# EAGLE design LN2 Autofill Connectors (EAGLE 9.6.2)
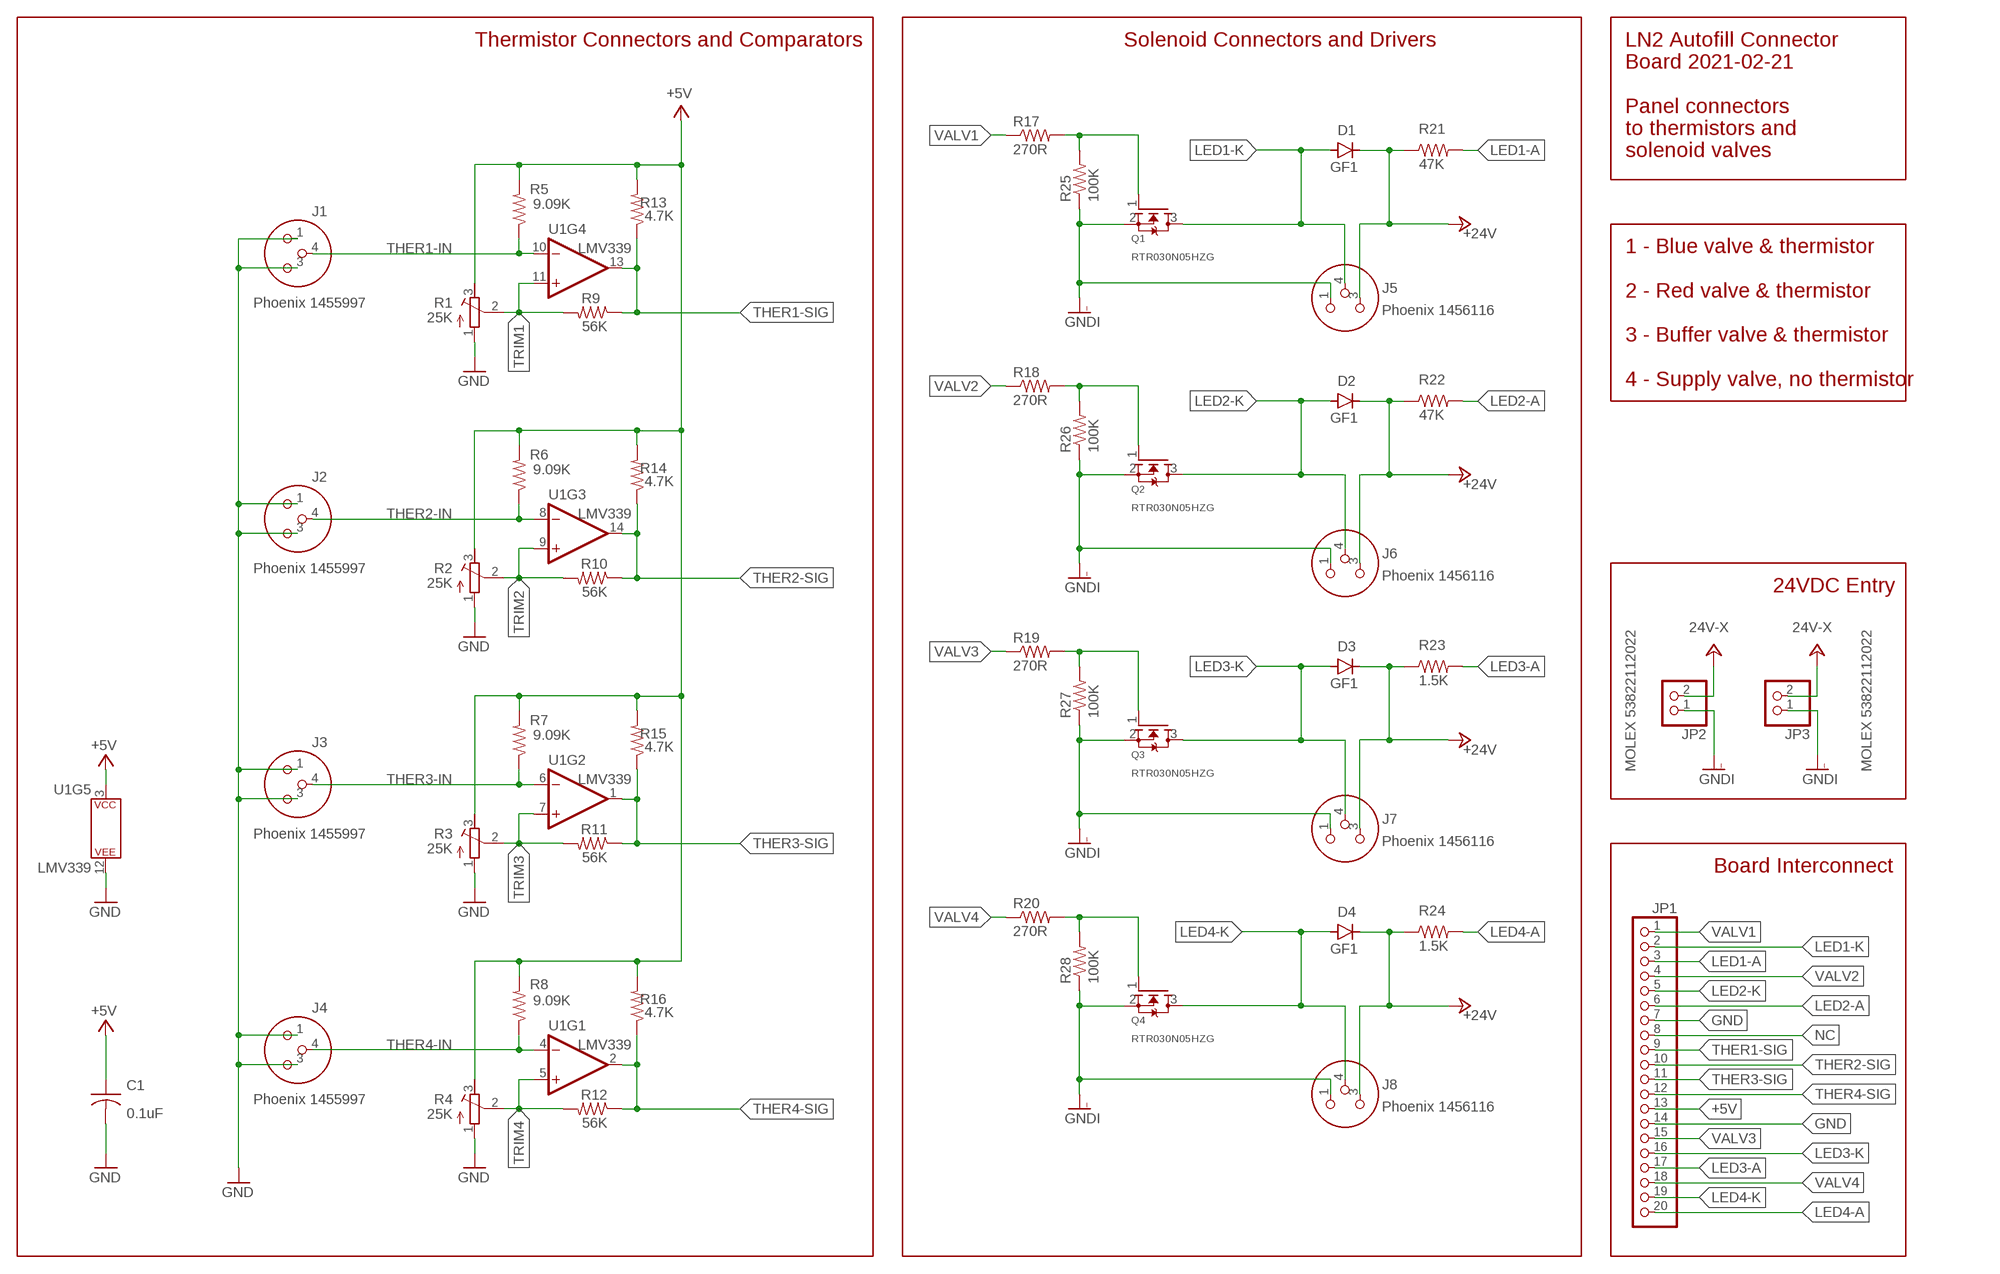
[diagram p0: schematic, sheet 1]

## Parts
C1  0.1uF  C-USC0805  [C0805]
D1  GF1  [SMA-DO214AC]
D2  GF1  [SMA-DO214AC]
D3  GF1  [SMA-DO214AC]
D4  GF1  [SMA-DO214AC]
J1  Phoenix 1455997  PHOENIX-3PIN-MALE  [PHOENIX-3PIN]
J2  Phoenix 1455997  PHOENIX-3PIN-MALE  [PHOENIX-3PIN]
J3  Phoenix 1455997  PHOENIX-3PIN-MALE  [PHOENIX-3PIN]
J4  Phoenix 1455997  PHOENIX-3PIN-MALE  [PHOENIX-3PIN]
J5  Phoenix 1456116  PHOENIX-3PIN-FEMALE  [PHOENIX-3PIN-FEMALE]
J6  Phoenix 1456116  PHOENIX-3PIN-FEMALE  [PHOENIX-3PIN-FEMALE]
J7  Phoenix 1456116  PHOENIX-3PIN-FEMALE  [PHOENIX-3PIN-FEMALE]
J8  Phoenix 1456116  PHOENIX-3PIN-FEMALE  [PHOENIX-3PIN-FEMALE]
JP1  PINHD-1X20  [1X20]
JP2  MOLEX 53822112022  PINHD-1X2MOLEX-02-VERT  [MOLEX-02-VERT]
JP3  MOLEX 53822112022  PINHD-1X2MOLEX-02-VERT  [MOLEX-02-VERT]
Q1  RTR030N05HZG  MOSFET-NREFLOW  [SOT23]
Q2  RTR030N05HZG  MOSFET-NREFLOW  [SOT23]
Q3  RTR030N05HZG  MOSFET-NREFLOW  [SOT23]
Q4  RTR030N05HZG  MOSFET-NREFLOW  [SOT23]
R1  25K  R-TRIMM3296Y  [RTRIM3296Y]
R2  25K  R-TRIMM3296Y  [RTRIM3296Y]
R3  25K  R-TRIMM3296Y  [RTRIM3296Y]
R4  25K  R-TRIMM3296Y  [RTRIM3296Y]
R5  9.09K  R-US_R0805  [R0805]
R6  9.09K  R-US_R0805  [R0805]
R7  9.09K  R-US_R0805  [R0805]
R8  9.09K  R-US_R0805  [R0805]
R9  56K  R-US_R0805  [R0805]
R10  56K  R-US_R0805  [R0805]
R11  56K  R-US_R0805  [R0805]
R12  56K  R-US_R0805  [R0805]
R13  4.7K  R-US_R0805  [R0805]
R14  4.7K  R-US_R0805  [R0805]
R15  4.7K  R-US_R0805  [R0805]
R16  4.7K  R-US_R0805  [R0805]
R17  270R  R-US_R0805  [R0805]
R18  270R  R-US_R0805  [R0805]
R19  270R  R-US_R0805  [R0805]
R20  270R  R-US_R0805  [R0805]
R21  47K  R-US_R0805  [R0805]
R22  47K  R-US_R0805  [R0805]
R23  1.5K  R-US_R0805  [R0805]
R24  1.5K  R-US_R0805  [R0805]
R25  100K  R-US_R0805  [R0805]
R26  100K  R-US_R0805  [R0805]
R27  100K  R-US_R0805  [R0805]
R28  100K  R-US_R0805  [R0805]
U1  LMV339  LM339SOIC-14  [SOIC127P599X175-14]

## Nets
+5V: C1.1 JP1.13 R1.3(E) R2.3(E) R3.3(E) R4.3(E) R5.2 R6.2 R7.2 R8.2 R13.2 R14.2 R15.2 R16.2 U1.3(P$V+)
+24V: D1.K(C) D2.K(C) D3.K(C) D4.K(C) J5.3 J6.3 J7.3 J8.3 JP2.2 JP3.2 R21.1 R22.1 R23.1 R24.1 ; supply symbol labelled 24V-X
GND: C1.2 J1.1 J1.3 J2.1 J2.3 J3.1 J3.3 J4.1 J4.3 JP1.7 JP1.14 R1.1(A) R2.1(A) R3.1(A) R4.1(A) U1.12(P$V-)
GNDI: J5.1 J6.1 J7.1 J8.1 JP2.1 JP3.1 Q1.2(S) Q2.2(S) Q3.2(S) Q4.2(S) R25.1 R26.1 R27.1 R28.1
LED1-A: JP1.3 R21.2
LED1-K: D1.A J5.4 JP1.2 Q1.3(D)
LED2-A: JP1.6 R22.2
LED2-K: D2.A J6.4 JP1.5 Q2.3(D)
LED3-A: JP1.17 R23.2
LED3-K: D3.A J7.4 JP1.16 Q3.3(D)
LED4-A: JP1.20 R24.2
LED4-K: D4.A J8.4 JP1.19 Q4.3(D)
N$1: Q1.1(G) R17.2 R25.2
N$2: Q2.1(G) R18.2 R26.2
N$3: Q3.1(G) R19.2 R27.2
N$4: Q4.1(G) R20.2 R28.2
NC: JP1.8
THER1-IN: J1.4 R5.1 U1.10(-IN)
THER1-SIG: JP1.9 R9.1 R13.1 U1.13(OUT)
THER2-IN: J2.4 R6.1 U1.8(-IN)
THER2-SIG: JP1.10 R10.1 R14.1 U1.14(OUT)
THER3-IN: J3.4 R7.1 U1.6(-IN)
THER3-SIG: JP1.11 R11.1 R15.1 U1.1(OUT)
THER4-IN: J4.4 R8.1 U1.4(-IN)
THER4-SIG: JP1.12 R12.1 R16.1 U1.2(OUT)
TRIM1: R1.2(S) R9.2 U1.11(+IN)
TRIM2: R2.2(S) R10.2 U1.9(+IN)
TRIM3: R3.2(S) R11.2 U1.7(+IN)
TRIM4: R4.2(S) R12.2 U1.5(+IN)
VALV1: JP1.1 R17.1
VALV2: JP1.4 R18.1
VALV3: JP1.15 R19.1
VALV4: JP1.18 R20.1

## Notes on the sheet
- Thermistor Connectors and Comparators | Solenoid Connectors and Drivers
- LN2 Autofill Connector
  Board 2021-02-21
  
  Panel connectors
  to thermistors and
  solenoid valves
- 1 - Blue valve & thermistor
  
  2 - Red valve & thermistor
  
  3 - Buffer valve & thermistor
  
  4 - Supply valve, no thermistor
- 24VDC Entry
- Board Interconnect

## Library data of the parts
C1 = AUmlib:C-US: CAPACITOR, American symbol; SPICEPREFIX: C
D1-D4 = AUmlib:GF1: DIODE
J1-J4 = AUmlib:PHOENIX-3PIN-MALE
J5-J8 = AUmlib:PHOENIX-3PIN-FEMALE: Phoenix Contact 3-pin circular M8 female PCB 1456116
JP1 = AUmlib:PINHD-1X20: PIN HEADER
JP2 JP3 = AUmlib:PINHD-1X2: PIN HEADER
Q1-Q4 = AUmlib:MOSFET-N: N-Channel Mosfet 2N7002E - 60V 260mA SOT23 [Digikey: 2N7002ET1GOSTR-ND] - REEL BSH103 - 30V 850mA SOT23 [Digikey: 568-5013-1-ND]
R1-R4 = AUmlib:R-TRIMM: Trimm resistor; SPICEMODEL: X; SPICEPREFIXL: POT
R5-R28 = AUmlib:R-US_: RESISTOR, American symbol; SPICEPREFIX: R
U1 = AUmlib:LM339: Quad Comparator - LM339PWR Based on information from the SLCS006N datasheet from TI (www.ti.com). Created by nick@scantool.net, 2008. Updated 2016. SparkFun Products SparkFun OBD-II UART <https://www.sparkfun.com/products/9555> (WIG-09555) SparkFun Car Diagnostics Kit <https://www.sparkfun.com/products/10769> (RTL-10769)

## Board
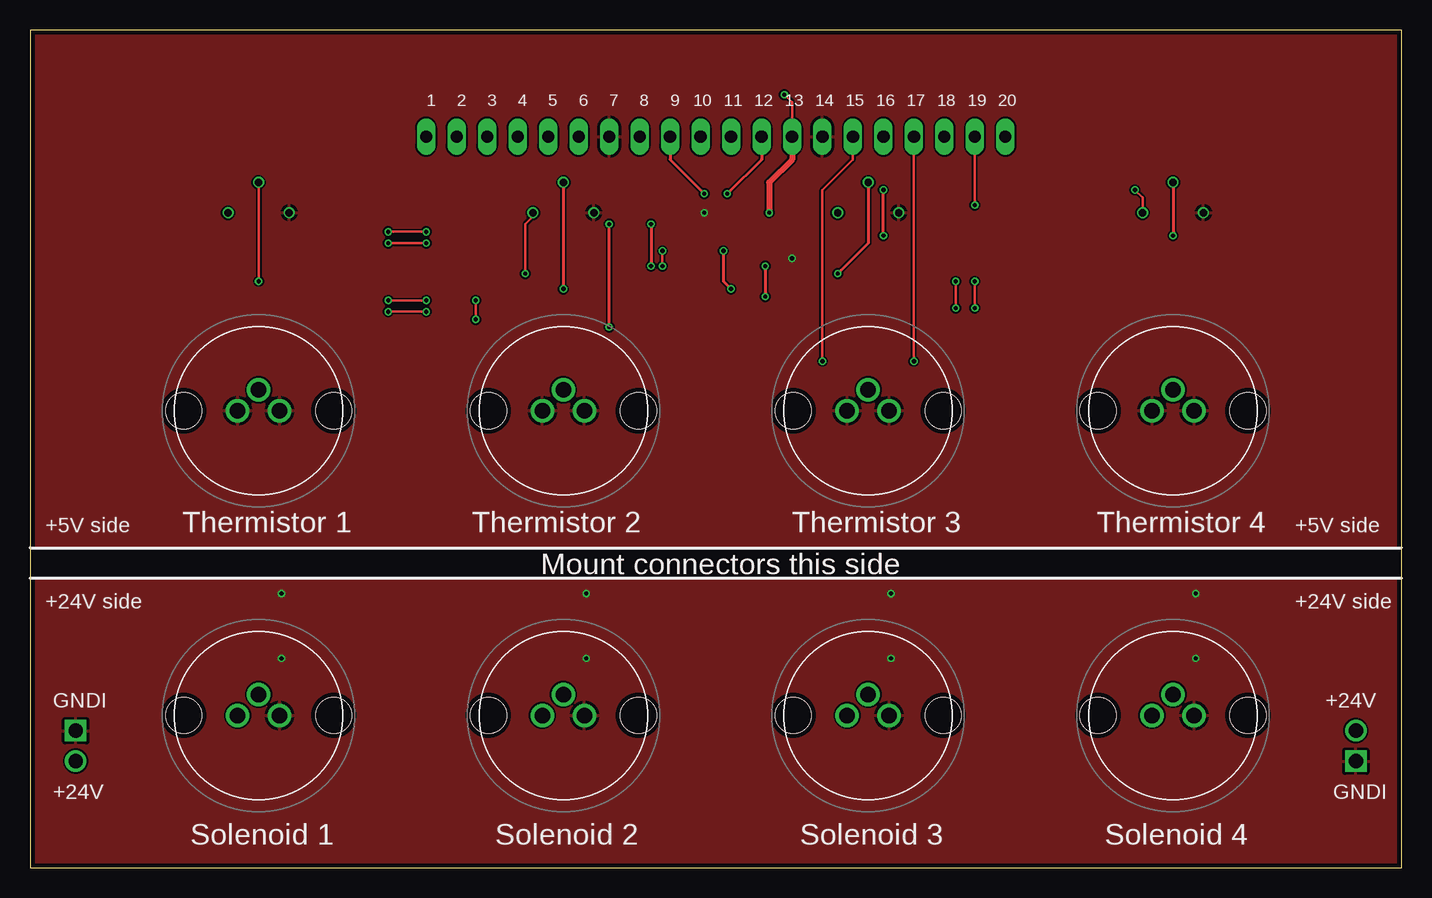
[diagram p1: board, top side]
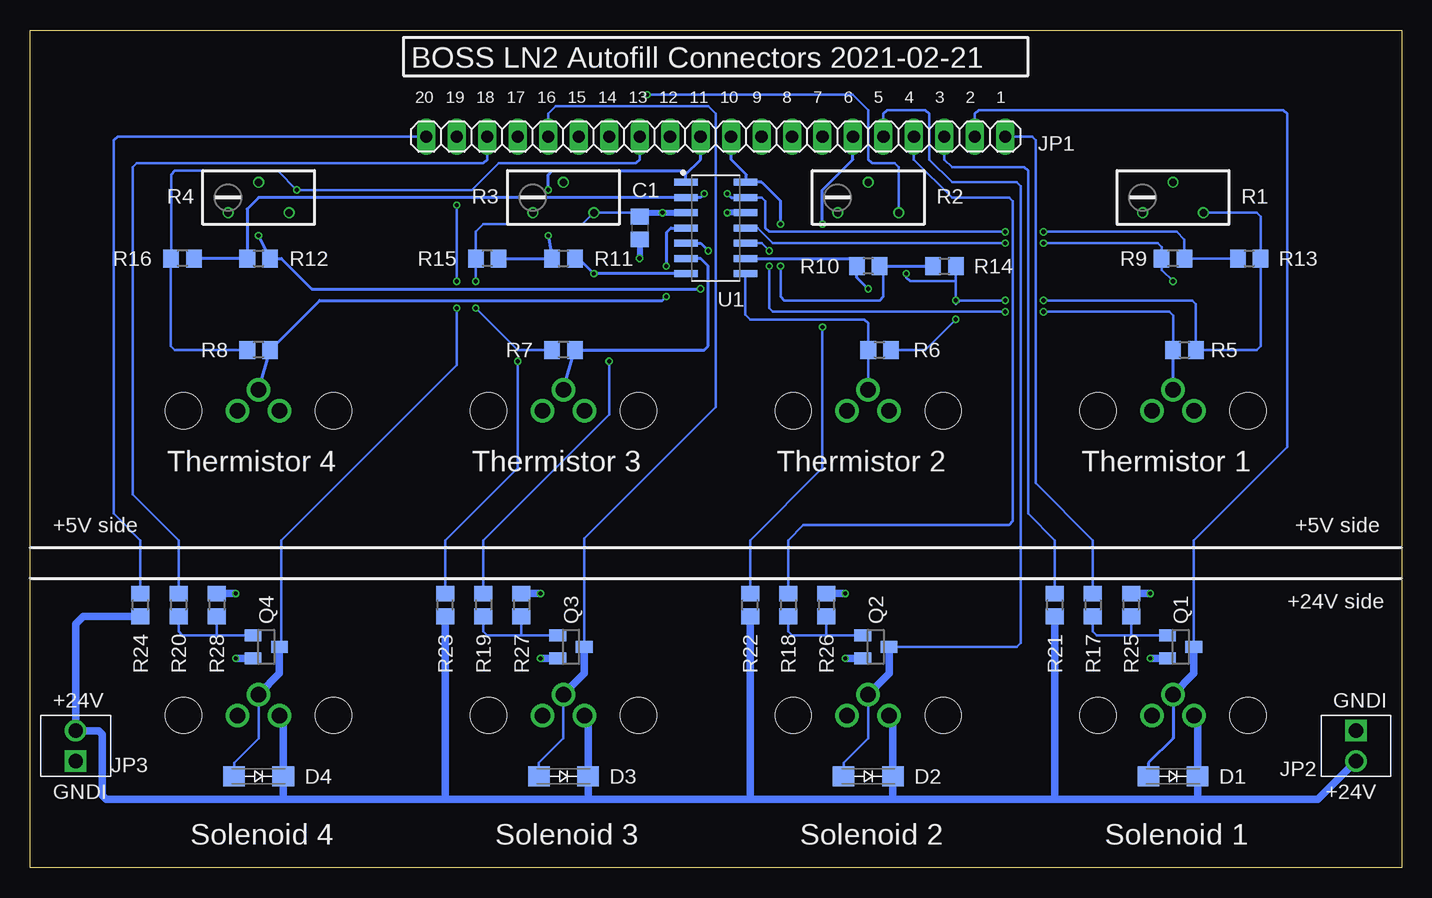
[diagram p2: board, bottom side, seen from below]

Size 114.3 x 69.85 mm. Coordinates in mm from the lower left corner, seen from the top.
Outline: 0,0 114.3,0 114.3,69.85 0,69.85 0,0
Copper layers (1*16): Top 0.035559375mm / dielectric 1.6mm / Bottom 0.035559375mm
Design rules "oshpark-2layer *": minimum track width 6mil, minimum drill 10mil, track to track 6mil, track to pad 6mil, pad to pad 6mil, via to via 6mil, smd to smd 6mil, copper to edge 15mil, drill to drill 6mil, minimum pad ring 5mil, minimum via ring 5mil, stop-mask expansion 2.5mil, vias tented up to drill 0mil, thermal gap 10mil

### Footprints (pad centres in the part's own frame; a part is rotated, then mirrored left to right if it is on the bottom)
C0805 = smd 1.3 x 1.5: 1 -0.95,0; 2 0.95,0
SMA-DO214AC = smd 1.8 x 1.7: A -2.05,0; K 2.05,0
PHOENIX-3PIN = drill 1.3: 1 1.75,0; 3 -1.75,0; 4 0,1.75 | hole 3: -6.25,0; 6.25,0
PHOENIX-3PIN-FEMALE = drill 1.3: 1 1.75,0; 3 -1.75,0; 4 0,1.75 | hole 3: -6.25,0; 6.25,0
1X20 = drill 1.016 long: 1 -24.13,0; 2 -21.59,0; 3 -19.05,0; 4 -16.51,0; 5 -13.97,0; 6 -11.43,0; 7 -8.89,0; 8 -6.35,0; 9 -3.81,0; 10 -1.27,0; 11 1.27,0; 12 3.81,0; 13 6.35,0; 14 8.89,0; 15 11.43,0; 16 13.97,0; 17 16.51,0; 18 19.05,0; 19 21.59,0; 20 24.13,0
MOLEX-02-VERT = drill 1.194 square: 1 0,0 | drill 1.194: 2 2.54,0
SOT23 = smd 1 x 1.4: 1 -0.95,-1.1; 2 0.95,-1.1; 3 0,1.1
RTRIM3296Y = drill 0.61: 1 1.27,-2.54; 2 -1.27,0; 3 1.27,2.54
R0805 = smd 1.3 x 1.5: 1 -0.95,0; 2 0.95,0
SOIC127P599X175-14 = smd 1.967 x 0.594: 1 -2.469,3.81; 2 -2.469,2.54; 3 -2.469,1.27; 4 -2.469,0; 5 -2.469,-1.27; 6 -2.469,-2.54; 7 -2.469,-3.81; 8 2.469,-3.81; 9 2.469,-2.54; 10 2.469,-1.27; 11 2.469,0; 12 2.469,1.27; 13 2.469,2.54; 14 2.469,3.81

### Placement (x,y rotation side)
C1  63.5,53.34 270 bottom
D1  19.05,7.62 0 bottom
D2  44.45,7.62 0 bottom
D3  69.85,7.62 0 bottom
D4  95.25,7.62 0 bottom
J1  19.05,38.1 0 top
J2  44.45,38.1 0 top
J3  69.85,38.1 0 top
J4  95.25,38.1 0 top
J5  19.05,12.7 0 top
J6  44.45,12.7 0 top
J7  69.85,12.7 0 top
J8  95.25,12.7 0 top
JP1  57.15,60.96 180 bottom
JP2  3.81,11.43 270 bottom
JP3  110.49,8.89 90 bottom
Q1  18.41,18.41 270 bottom
Q2  43.81,18.41 270 bottom
Q3  69.22,18.41 270 bottom
Q4  94.61,18.41 270 bottom
R1  19.05,55.88 270 bottom
R2  44.45,55.88 270 bottom
R3  69.85,55.88 270 bottom
R4  95.25,55.88 270 bottom
R5  18.1,43.18 0 bottom
R6  43.5,43.18 0 bottom
R7  69.85,43.18 180 bottom
R8  95.25,43.18 180 bottom
R9  19.05,50.8 180 bottom
R10  44.45,50.16 180 bottom
R11  69.85,50.8 0 bottom
R12  95.25,50.8 0 bottom
R13  12.7,50.8 0 bottom
R14  38.1,50.16 0 bottom
R15  76.2,50.8 180 bottom
R16  101.6,50.8 180 bottom
R17  25.72,21.91 270 bottom
R18  51.12,21.91 270 bottom
R19  76.52,21.91 270 bottom
R20  101.92,21.91 270 bottom
R21  1.5K  [R0805]  28.89,21.91 90 bottom
R22  1.5K  [R0805]  54.29,21.91 90 bottom
R23  79.69,21.91 90 bottom
R24  105.09,21.91 90 bottom
R25  22.54,21.91 270 bottom
R26  47.94,21.91 270 bottom
R27  73.34,21.91 270 bottom
R28  98.74,21.91 270 bottom
U1  57.15,53.34 0 bottom

### Tracks (layer width: path | path; a pad name or v marks a point on that pad's centre or on a via)
+5V  (via drill 0.35)
  Top 0.203: v37.15,47.31 v37.15,45.72 | R2.3 41.91,54.29 41.27,53.66 v41.27,49.53 | v92.08,56.52 92.71,55.88 R4.3 | v77.15,48.9 v77.15,46.67 | v62.87,64.45 63.5,63.82 JP1.13 | v29.84,47.31 v33.02,47.31
  Top 0.508: JP1.13 63.5,59.05 61.59,57.15 v61.59,54.61
  Bottom 0.203: R1.3 12.06,54.61 11.75,54.29 R13.2 11.75,43.5 12.06,43.18 R5.2 17.14,46.99 17.46,47.31 v29.84,47.31 | R14.2 37.15,48.9 | 37.15,48.9 v37.15,47.31 | v37.15,47.31 37.15,46.99 36.84,47.31 v33.02,47.31 | v37.15,47.31 | v37.15,45.72 39.69,43.18 R6.2 | v41.27,49.53 41.27,49.21 40.96,48.9 37.15,48.9 | 63.34,54.45 63.5,54.61 R3.3 68.26,53.66 76.52,53.66 77.15,53.02 R15.2 v77.15,48.9 | JP1.13 63.5,59.05 63.82,58.74 75.25,58.74 77.47,56.52 v92.08,56.52 93.66,58.1 102.23,58.1 102.55,57.79 R16.2 102.55,43.5 102.23,43.18 R8.2 | v77.15,46.67 73.66,43.18 R7.2 | R2.3 41.91,58.42 42.23,58.74 44.13,58.74 44.45,59.05 44.45,63.18 45.72,64.45 v62.87,64.45
  Bottom 0.508: U1.3 v61.59,54.61 v61.6,54.61 63.18,54.61 63.34,54.45 C1.1
  Bottom 0.61: R13.2
+24V
  Bottom 0.61: J5.3 17,12.4 D1.K 17,5.86 17.14,5.71 | J6.3 42.4,12.4 D2.K 42.4,5.89 42.23,5.71 | J7.3 67.8,12.4 D3.K 67.8,5.86 67.94,5.71 | J8.3 93.2,12.4 D4.K 93.2,5.86 93.34,5.71 | R24.1 109.85,20.96 110.49,20.32 JP3.2 108.58,11.43 108.27,11.11 108.27,6.03 107.95,5.71 93.34,5.71 | JP2.2 6.99,5.71 17.14,5.71 | 17.14,5.71 28.89,5.71 | 28.89,5.71 42.23,5.71 | 42.23,5.71 54.29,5.71 | 54.29,5.71 67.94,5.71 | 67.94,5.71 79.69,5.71 | 79.69,5.71 93.34,5.71 | R21.1 28.89,5.71 | R22.1 54.29,5.71 | R23.1 79.69,5.71
GND  (via drill 0.35)
  Bottom 0.508: C1.2 v63.5,50.8 | U1.12 v56.2,54.61
  pour Top: 0,69.85 114.3,69.85 114.3,26.67 0,26.67
GNDI  (via drill 0.35)
  Bottom 0.61: Q1.2 v20.95,17.46 | v20.95,22.86 v20.96,22.86 R25.1 | Q2.2 v46.35,17.46 | R26.1 v46.36,22.86 v46.35,22.86 | Q3.2 v71.75,17.46 | R27.1 v71.76,22.86 v71.75,22.86 | Q4.2 v97.16,17.46 | R28.1 v97.16,22.86
  pour Top: 0,0 0,24.13 114.3,24.13 114.3,0
LED1-A
  Bottom 0.203: JP1.3 38.1,59.05 37.47,58.42 31.43,58.42 31.11,58.1 31.11,29.53 28.89,27.3 R21.2
LED1-K
  Bottom 0.203: JP1.2 35.56,62.87 35.24,63.18 9.84,63.18 9.53,62.87 9.53,35.09 17.32,27.3 Q1.3
  Bottom 0.254: J5.4 19.05,10.79 21.1,8.74 D1.A
  Bottom 0.61: J5.4 17.32,16.18 Q1.3
LED2-A  (via drill 0.35)
  Top 0.254: v48.26,45.09 v48.26,53.66
  Bottom 0.203: v48.26,45.09 48.26,33.34 54.29,27.3 R22.2
  Bottom 0.254: v48.26,53.66 48.26,56.52 45.72,59.05 JP1.6
LED2-K
  Bottom 0.203: JP1.5 43.18,62.87 42.86,63.18 39.69,63.18 39.37,62.87 39.37,59.05 37.47,57.15 32.07,57.15 31.75,56.83 31.75,18.73 32.07,18.41 Q2.3 | J6.4 44.45,10.79 46.5,8.74 D2.A
  Bottom 0.61: Q2.3 42.72,16.18 J6.4
LED3-A  (via drill 0.35)
  Top 0.203: v73.66,42.23 JP1.17
  Bottom 0.203: v73.66,42.23 73.66,33.34 79.69,27.3 R23.2
LED3-K
  Bottom 0.203: JP1.16 71.12,62.87 70.48,63.5 57.78,63.5 57.15,62.87 57.15,38.42 68.11,27.45 Q3.3 | J7.4 69.85,10.79 71.9,8.74 D3.A
  Bottom 0.61: Q3.3 68.11,16.18 J7.4
LED4-A
  Bottom 0.203: R24.2 105.09,27.3 107.31,29.53 107.31,60.64 107,60.96 JP1.20
LED4-K  (via drill 0.35)
  Top 0.203: v78.74,46.67 v78.74,48.9 | v78.74,55.24 JP1.19
  Bottom 0.203: D4.A 97.3,8.74 95.25,10.79 J8.4 | Q4.3 93.34,18.59 93.34,27.3 78.74,41.91 v78.74,46.67 | v78.74,48.9 v78.74,55.24
  Bottom 0.61: Q4.3 93.52,16.18 J8.4
N$1
  Bottom 0.203: Q1.1 22.54,19.36 | 22.54,19.36 25.4,19.36 25.72,19.68 R17.2 | R25.2 22.54,19.36
N$2
  Bottom 0.203: Q2.1 47.94,19.36 | 47.94,19.36 50.8,19.36 51.12,19.68 R18.2 | R26.2 47.94,19.36
N$3
  Bottom 0.203: Q3.1 73.34,19.36 | 73.34,19.36 76.2,19.36 76.52,19.68 R19.2 | R27.2 73.34,19.36
N$4
  Bottom 0.203: Q4.1 98.74,19.37 | 98.74,19.37 101.6,19.37 101.92,19.68 R20.2 | R28.2 98.74,19.37
THER1-IN  (via drill 0.35)
  Top 0.203: v52.7,51.44 v52.7,50.16 | v33.02,46.35 v29.84,46.35
  Bottom 0.203: R5.1 19.05,46.04 19.36,46.35 v29.84,46.35 | v52.7,51.44 53.34,52.07 U1.10 | v52.7,50.16 52.7,46.67 52.39,46.35 v33.02,46.35
  Bottom 0.254: J1.4 R5.1
THER1-SIG  (via drill 0.35)
  Top 0.203: v29.84,53.02 v33.02,53.02
  Top 0.254: JP1.9 53.34,59.05 v56.2,56.2
  Bottom 0.203: R13.1 R9.1 18.1,52.39 18.73,53.02 v29.84,53.02 | U1.13 53.34,55.88 53.02,55.56 53.02,53.34 52.7,53.02 v33.02,53.02
  Bottom 0.254: v56.2,56.2 55.88,55.88 U1.13
THER2-IN
  Bottom 0.203: R6.1 44.45,45.4 44.77,45.72 54.29,45.72 54.68,46.11 U1.8 | J2.4 R6.1
  Bottom 0.254: R6.1
THER2-SIG  (via drill 0.35)
  Top 0.254: v51.75,53.66 v51.75,50.16
  Bottom 0.203: 43.18,49.84 43.18,47.62 43.5,47.31 51.44,47.31 51.75,47.62 v51.75,50.16
  Bottom 0.254: JP1.10 55.88,59.05 54.61,57.78 54.61,57.22 U1.14 53.34,57.15 51.75,55.56 v51.75,53.66 | R14.1 R10.1 43.18,49.84
THER3-IN
  Bottom 0.254: U1.6 58.42,50.8 57.78,50.16 57.78,43.5 58.1,43.18 R7.1 J3.4
THER3-SIG  (via drill 0.35)
  Top 0.254: v71.12,52.7 v71.12,56.52
  Bottom 0.254: U1.1 59.69,57.22 59.69,57.78 | 59.69,57.78 58.42,59.05 JP1.11 | v71.12,56.52 71.12,57.78 70.8,58.1 60.01,58.1 59.69,57.78 | R15.1 R11.1 v71.12,52.7
THER4-IN  (via drill 0.35)
  Top 0.254: v61.28,50.16 v61.28,47.62
  Bottom 0.254: v61.28,47.62 61.59,47.31 90.17,47.31 R8.1 J4.4 | v61.28,50.16 61.28,52.95 60.89,53.34 U1.4
THER4-SIG  (via drill 0.35)
  Top 0.254: JP1.12 60.96,59.05 v58.1,56.2
  Bottom 0.254: v58.1,56.2 58.42,55.88 U1.2 95.25,55.88 96.2,54.93 R12.1 R16.1
TRIM1  (via drill 0.35)
  Top 0.203: R1.2 v19.05,48.9 | v29.84,52.07 v33.02,52.07
  Bottom 0.203: U1.11 53.66,53.34 52.39,52.07 v33.02,52.07 | v19.05,48.9 20,49.84 R9.2 20,51.75 20.32,52.07 v29.84,52.07
TRIM2  (via drill 0.35)
  Top 0.254: R2.2 v44.45,48.26
  Bottom 0.254: U1.9 46.03,50.8 R10.2 45.4,49.21 v44.45,48.26
TRIM3  (via drill 0.35)
  Top 0.254: R3.2 69.85,52.07 v67.31,49.53
  Bottom 0.254: U1.7 v67.31,49.53 68.58,50.8 R11.2
TRIM4  (via drill 0.35)
  Top 0.254: R4.2 v95.25,52.7 | v57.78,51.44 57.78,48.9 v58.42,48.26
  Bottom 0.254: U1.5 58.42,52.07 v57.78,51.44 | v58.42,48.26 90.81,48.26 93.34,50.8 R12.2 v95.25,52.7
VALV1
  Bottom 0.203: JP1.1 30.8,60.96 30.48,60.64 30.48,32.07 25.72,27.3 R17.1
VALV2
  Bottom 0.203: JP1.4 40.64,59.05 37.47,55.88 32.7,55.88 32.38,55.56 32.38,28.89 32.7,28.57 49.85,28.57 51.12,27.3 R18.1
VALV3  (via drill 0.35)
  Top 0.203: v66.04,42.23 66.04,56.52 68.58,59.05 JP1.15
  Bottom 0.203: v66.04,42.23 66.04,37.78 76.52,27.3 R19.1
VALV4
  Bottom 0.203: R20.1 101.92,27.3 105.73,31.11 105.73,58.42 105.41,58.74 76.52,58.74 76.2,59.05 JP1.18

### Text on the board
tPlace: 1 | 2 | 3 | 4 | 5 | 6 | 7 | 8 | 9 | 10 | 11 | 12 | 13 | 14 | 15 | 16 | 17 | 18 | 19 | 20 | +5V side | Thermistor 1 | Thermistor 2 | Thermistor 3 | Thermistor 4 | +5V side | Mount connectors this side | +24V side | +24V side | GNDI | +24V | +24V | GNDI | Solenoid 1 | Solenoid 2 | Solenoid 3 | Solenoid 4
bPlace: BOSS LN2 Autofill Connectors 2021-02-21 | 1 | 2 | 3 | 4 | 5 | 6 | 7 | 8 | 9 | 10 | 11 | 12 | 13 | 14 | 15 | 16 | 17 | 18 | 19 | 20 | Thermistor 1 | Thermistor 2 | Thermistor 3 | Thermistor 4 | +5V side | +5V side | +24V side | GNDI | +24V | +24V | GNDI | Solenoid 1 | Solenoid 2 | Solenoid 3 | Solenoid 4